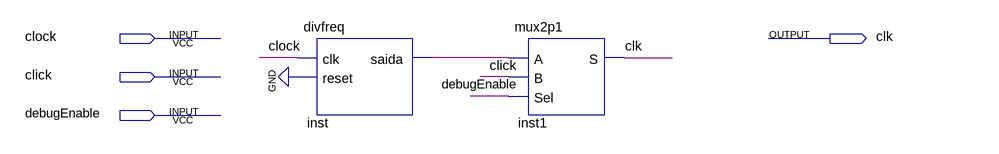
[diagram p0: schematic sheet]
// Quartus schematic run_debug_mode.bdf as structural Verilog: 2 symbols, 4 pins
module run_debug_mode (
  input  clock,
  input  click,
  input  debugEnable,
  output clk
);

  wire inst_saida;

  divfreq inst (.clk(clock), .reset(1'b0), .saida(inst_saida));
  mux2p1 inst1 (.A(inst_saida), .B(click), .Sel(debugEnable), .S(clk));
endmodule
